# EAGLE design buttons (EAGLE 8.4.1)
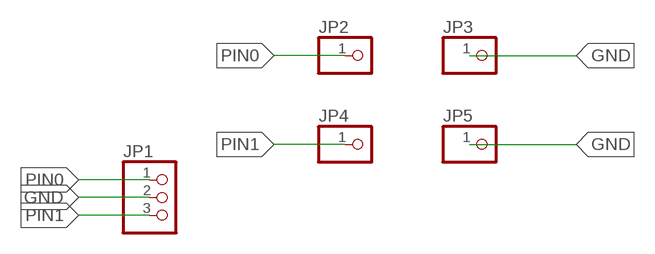
[diagram p0: schematic, sheet 1]

## Parts
JP1  PINHD-1X3  [1X03]
JP2  PINHD-1X1  [1X01]
JP3  PINHD-1X1  [1X01]
JP4  PINHD-1X1  [1X01]
JP5  PINHD-1X1  [1X01]

## Nets
GND: JP1.2 JP3.1 JP5.1
PIN0: JP1.1 JP2.1
PIN1: JP1.3 JP4.1

## Library data of the parts
JP1 = pinhead:PINHD-1X3: PIN HEADER
JP2-JP5 = pinhead:PINHD-1X1: PIN HEADER

## Board
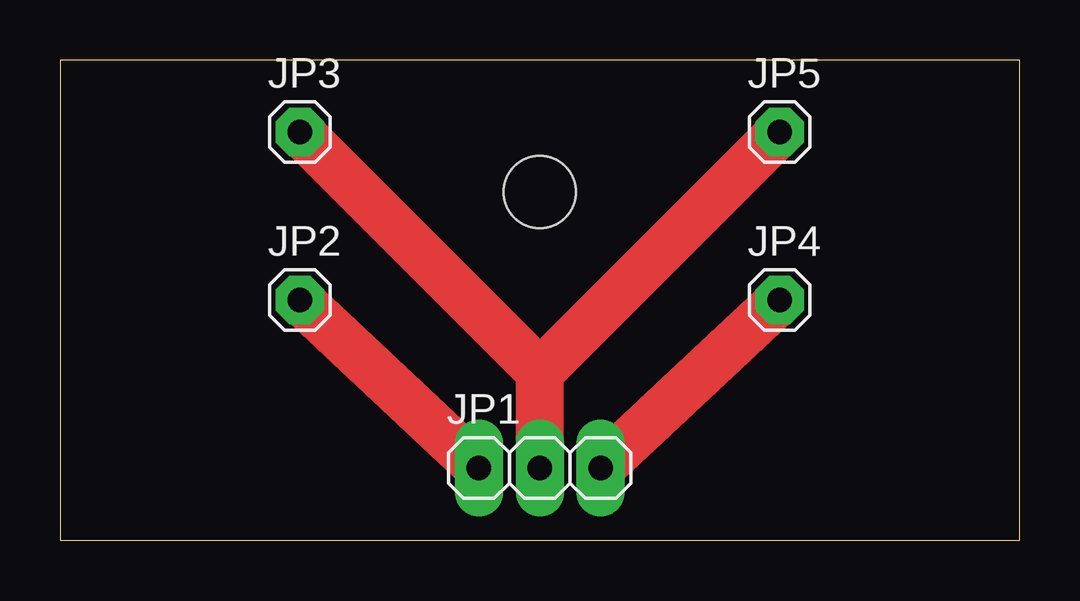
[diagram p1: board, top side]

Size 40 x 20 mm. Coordinates in mm from the lower left corner, seen from the top.
Outline: 0,0 40,0 40,20 0,20 0,0
Copper layers 1: Top 0.035mm
Design rules "default *": minimum track width 30mil, minimum drill 0.35mm, track to track 6mil, track to pad 6mil, pad to pad 6mil, via to via 6mil, smd to smd 6mil, copper to edge 40mil, drill to drill 6mil, minimum pad ring 0.5mm, minimum via ring 8mil, stop-mask expansion 4mil, vias tented up to drill 0mil, thermal gap 10mil
Holes 3 mm at 20,14.5

### Footprints (pad centres in the part's own frame; a part is rotated, then mirrored left to right if it is on the bottom)
1X03 = drill 1.016 long: 1 -2.54,0; 2 0,0; 3 2.54,0
1X01 = drill 1.016 octagon: 1 0,0

### Placement (x,y rotation side)
JP1  20,3 0 top
JP2  10,10 0 top
JP3  10,17 0 top
JP4  30,10 0 top
JP5  30,17 0 top

### Tracks (layer width: path | path; a pad name or v marks a point on that pad's centre or on a via)
GND
  Top 2: JP3.1 20,7 | JP1.2 20,7 | 20,7 JP5.1
PIN0
  Top 2: JP1.1 JP2.1
PIN1
  Top 2: JP1.3 JP4.1